# EAGLE design btpro (EAGLE 9.4.2)
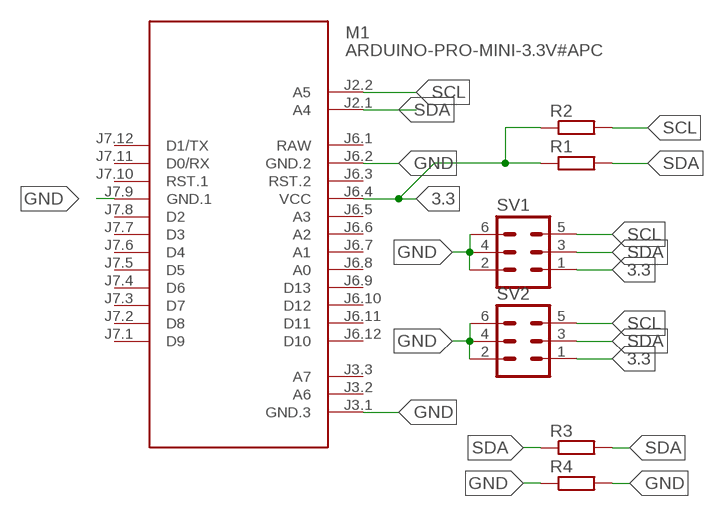
[diagram p0: schematic, sheet 1]

## Parts
M1  ARDUINO-PRO-MINI-3.3V#APC  [ARDUINO-PRO-MINI#APC]
R1  R-EU_0411/12  [0411/12]
R2  R-EU_0411/12  [0411/12]
R3  R-EU_0207/10  [0207/10]
R4  R-EU_0207/10  [0207/10]
SV1  ML6  [ML6]
SV2  ML6  [ML6]

## Nets
3.3: M1.J6.4(VCC) R1.1 R2.1 SV1.1 SV2.1
GND: M1.J3.1(GND.3) M1.J6.2(GND.2) M1.J7.9(GND.1) R4.1 R4.2 SV1.2 SV1.4 SV1.6 SV2.2 SV2.4 SV2.6
SCL: M1.J2.2(A5) R2.2 SV1.5 SV2.5
SDA: M1.J2.1(A4) R1.2 R3.1 R3.2 SV1.3 SV2.3
Unconnected: M1.J3.2(A6) M1.J3.3(A7) M1.J6.3(RST.2) M1.J6.5(A3) M1.J6.6(A2) M1.J6.7(A1) M1.J6.8(A0) M1.J6.9(D13) M1.J6.10(D12) M1.J6.11(D11) M1.J6.12(D10) M1.J7.1(D9) M1.J7.2(D8) M1.J7.3(D7) M1.J7.4(D6) M1.J7.5(D5) M1.J7.6(D4) M1.J7.7(D3) M1.J7.8(D2) M1.J7.10(RST.1) M1.J7.11(D0/RX) M1.J7.12(D1/TX)

## Power pins joined to a net without a drawn wire
RAW: M1.J6.1(RAW)

## Library data of the parts
M1 = diy-modules:ARDUINO-PRO-MINI-*#APC: Arduino Pro Mini (and compatible devices) with angle programming connector More details available here: https://www.arduino.cc/en/Main/ArduinoBoardProMini Click here to find device on ebay.com <http://www.ebay.com/sch/arduino+pro+mini>
R1-R4 = rcl:R-EU_: RESISTOR, European symbol; SPICEPREFIX: R
SV1 SV2 = con-ml:ML6: HARTING; OC_FARNELL: unknown; OC_NEWARK: unknown

## Board
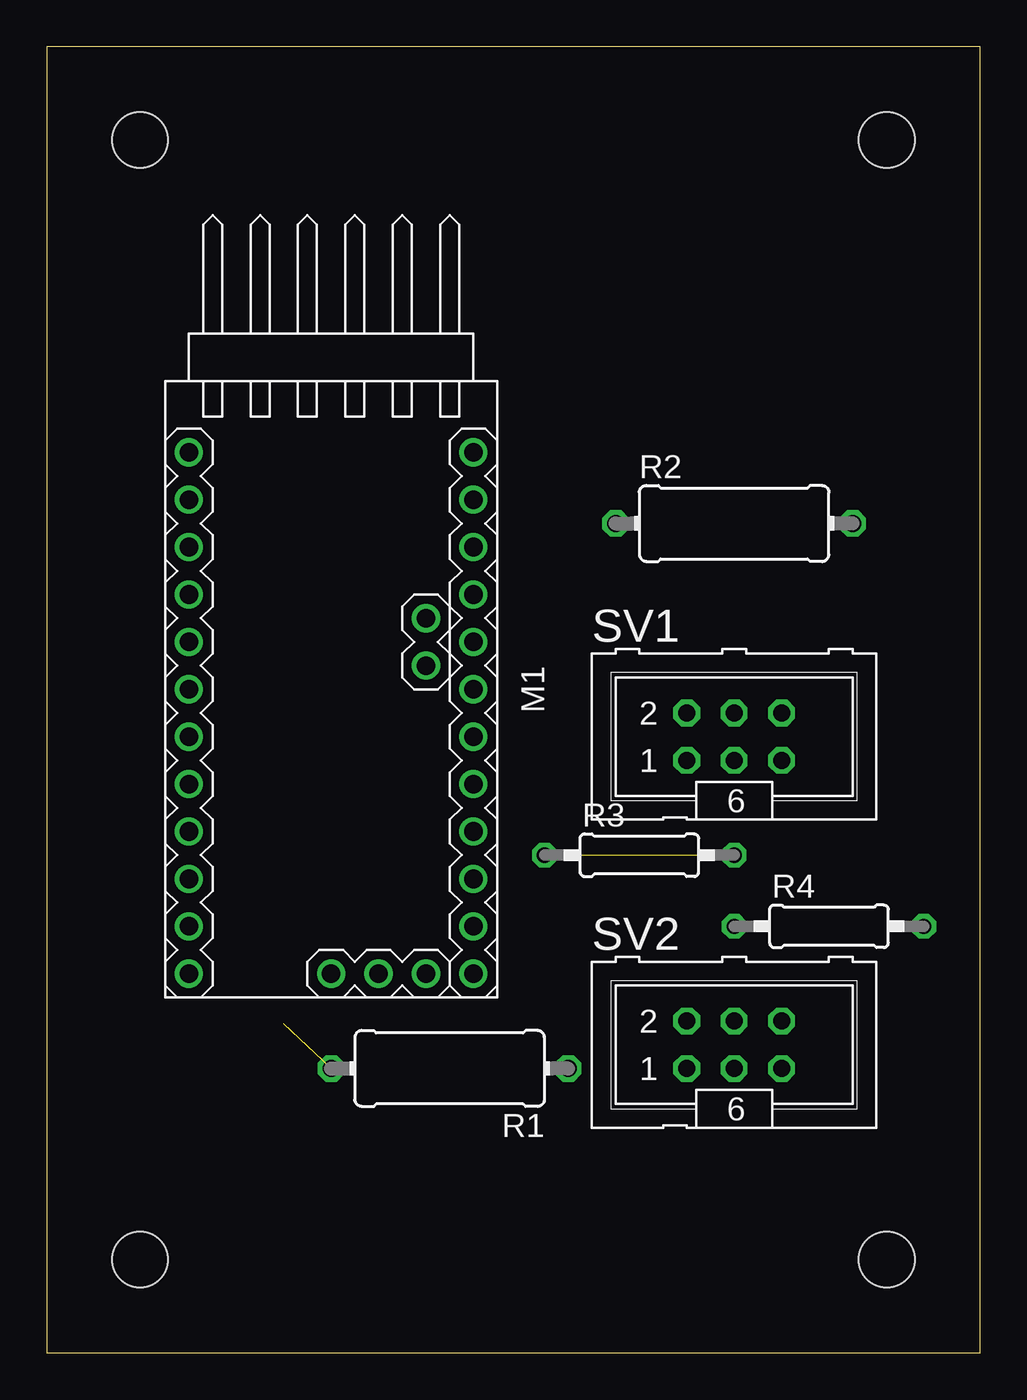
[diagram p1: board, top side]
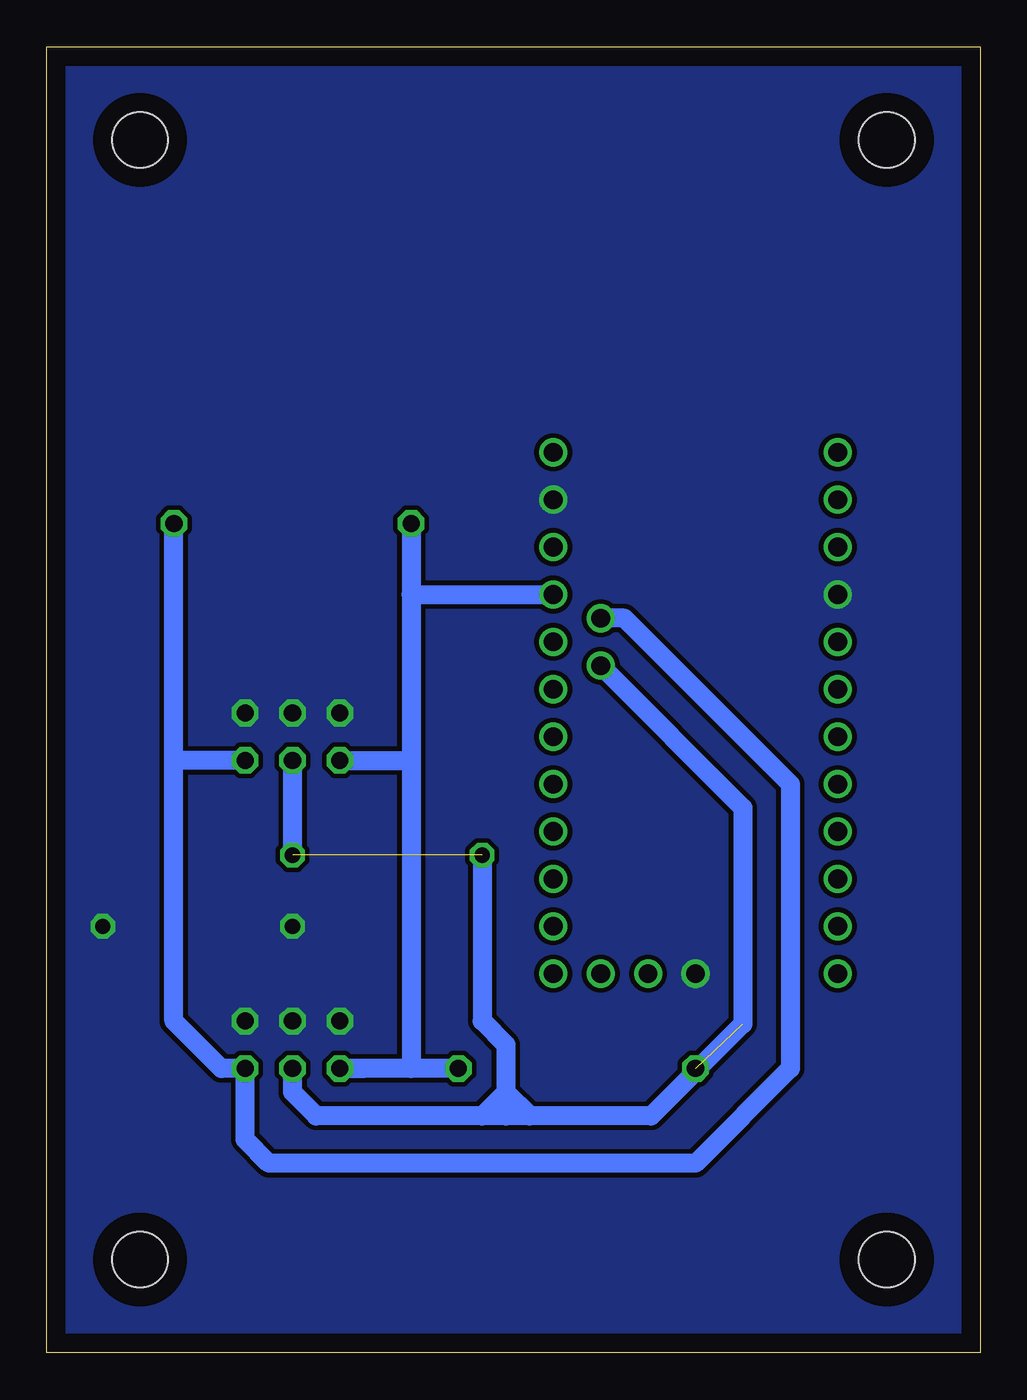
[diagram p2: board, bottom side, seen from below]

Size 50 x 70 mm. Coordinates in mm from the lower left corner, seen from the top.
Outline: 0,0 50,0 50,70 0,70 0,0
Copper layers (1*16): Top 0.035mm / dielectric 1.5mm / Bottom 0.035mm
Design rules "default": minimum track width 6mil, minimum drill 0.35mm, track to track 6mil, track to pad 6mil, pad to pad 6mil, via to via 6mil, smd to smd 6mil, copper to edge 40mil, drill to drill 6mil, minimum pad ring 10mil, minimum via ring 8mil, stop-mask expansion 4mil, vias tented up to drill 0mil, thermal gap 10mil
Holes 3 mm at 5,65 45,65 45,5 5,5

### Footprints (pad centres in the part's own frame; a part is rotated, then mirrored left to right if it is on the bottom)
ARDUINO-PRO-MINI#APC = drill 1: J2.1 -1.27,5.08; J2.2 -3.81,5.08; J3.1 15.24,0; J3.2 15.24,2.54; J3.3 15.24,5.08; J6.1 -12.7,7.62; J6.2 -10.16,7.62; J6.3 -7.62,7.62; J6.4 -5.08,7.62; J6.5 -2.54,7.62; J6.6 0,7.62; J6.7 2.54,7.62; J6.8 5.08,7.62; J6.9 7.62,7.62; J6.10 10.16,7.62; J6.11 12.7,7.62; J6.12 15.24,7.62; J7.1 15.24,-7.62; J7.2 12.7,-7.62; J7.3 10.16,-7.62; J7.4 7.62,-7.62; J7.5 5.08,-7.62; J7.6 2.54,-7.62; J7.7 0,-7.62; J7.8 -2.54,-7.62; J7.9 -5.08,-7.62; J7.10 -7.62,-7.62; J7.11 -10.16,-7.62; J7.12 -12.7,-7.62
0411/12 = drill 0.914 octagon: 1 -6.35,0; 2 6.35,0
0207/10 = drill 0.813 octagon: 1 -5.08,0; 2 5.08,0
ML6 = drill 0.914 octagon: 1 -2.54,-1.27; 2 -2.54,1.27; 3 0,-1.27; 4 0,1.27; 5 2.54,-1.27; 6 2.54,1.27

### Placement (x,y rotation side)
M1  15.24,35.56 270 top
R1  21.59,15.24 180 top
R2  36.83,44.45 0 top
R3  31.75,26.67 0 top
R4  41.91,22.86 0 top
SV1  36.83,33.02 0 top
SV2  36.83,16.51 0 top

### Tracks (layer width: path | path; a pad name or v marks a point on that pad's centre or on a via)
3.3
  Bottom 1.016: 33.02,15.24 SV2.1 30.48,15.24 | R2.1 30.48,40.64 | 30.48,40.64 M1.J6.4 | 30.48,40.64 30.48,31.75 | SV1.1 30.48,31.75 | R1.1 30.48,15.24 | 30.48,31.75 30.48,15.24
GND
  pour Bottom (isolate 0.254, no thermals): 0,0 50.8,0 50.8,69.85 0,69.85
SCL
  Bottom 1.016: M1.J2.2 19.05,39.37 10.16,30.48 10.16,15.24 15.24,10.16 38.1,10.16 39.37,11.43 SV2.5 40.64,15.24 43.18,17.78 43.18,31.75 | 43.18,31.75 R2.2 | SV1.5 43.18,31.75
SDA  (2 unrouted)
  Bottom 1.016: M1.J2.1 12.7,29.21 12.7,17.62 17.62,12.7 24.13,12.7 | 24.13,12.7 25.4,12.7 | 25.4,12.7 26.67,12.7 | 26.67,12.7 35.56,12.7 36.83,13.97 SV2.3 | R3.2 SV1.3 | R3.1 26.67,17.78 25.4,16.51 25.4,13.97 | 25.4,13.97 25.4,12.7 | 24.13,12.7 25.4,13.97 | 25.4,13.97 26.67,12.7